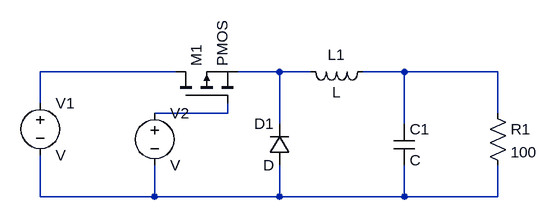
[diagram p0: schematic BuckConverter.asc]
BuckConverter.asc, the LTspice schematic file:
Version 4.1
SHEET 1 880 680
WIRE 0 80 -208 80
WIRE 160 80 96 80
WIRE 208 80 160 80
WIRE 352 80 288 80
WIRE 496 80 352 80
WIRE -208 128 -208 80
WIRE 80 144 80 128
WIRE 80 144 -32 144
WIRE 496 144 496 80
WIRE 160 160 160 80
WIRE 352 160 352 80
WIRE -208 272 -208 208
WIRE -32 272 -32 224
WIRE -32 272 -208 272
WIRE 160 272 160 224
WIRE 160 272 -32 272
WIRE 352 272 352 224
WIRE 352 272 160 272
WIRE 496 272 496 224
WIRE 496 272 352 272
SYMBOL ind 304 64 R90
WINDOW 0 5 56 VBottom 2
WINDOW 3 32 56 VTop 2
SYMATTR InstName L1
SYMBOL cap 336 160 R0
SYMATTR InstName C1
SYMBOL diode 176 224 R180
WINDOW 0 24 64 Left 2
WINDOW 3 24 0 Left 2
SYMATTR InstName D1
SYMBOL res 480 128 R0
SYMATTR InstName R1
SYMATTR Value 100
SYMBOL voltage -208 112 R0
SYMATTR InstName V1
SYMBOL pmos 0 128 R270
SYMATTR InstName M1
SYMBOL voltage -32 128 R0
SYMATTR InstName V2

The netlist it stands for:
* BuckConverter.asc
L1 N003 N002 L
C1 N003 N005 C
D1 N005 N002 D
R1 N003 N005 100
V1 N001 N005 V
M1 N001 N004 N002 N002 PMOS
V2 N004 N005 V
.model D D
.lib standard.dio
.model NMOS NMOS
.model PMOS PMOS
.lib standard.mos
.backanno
.end